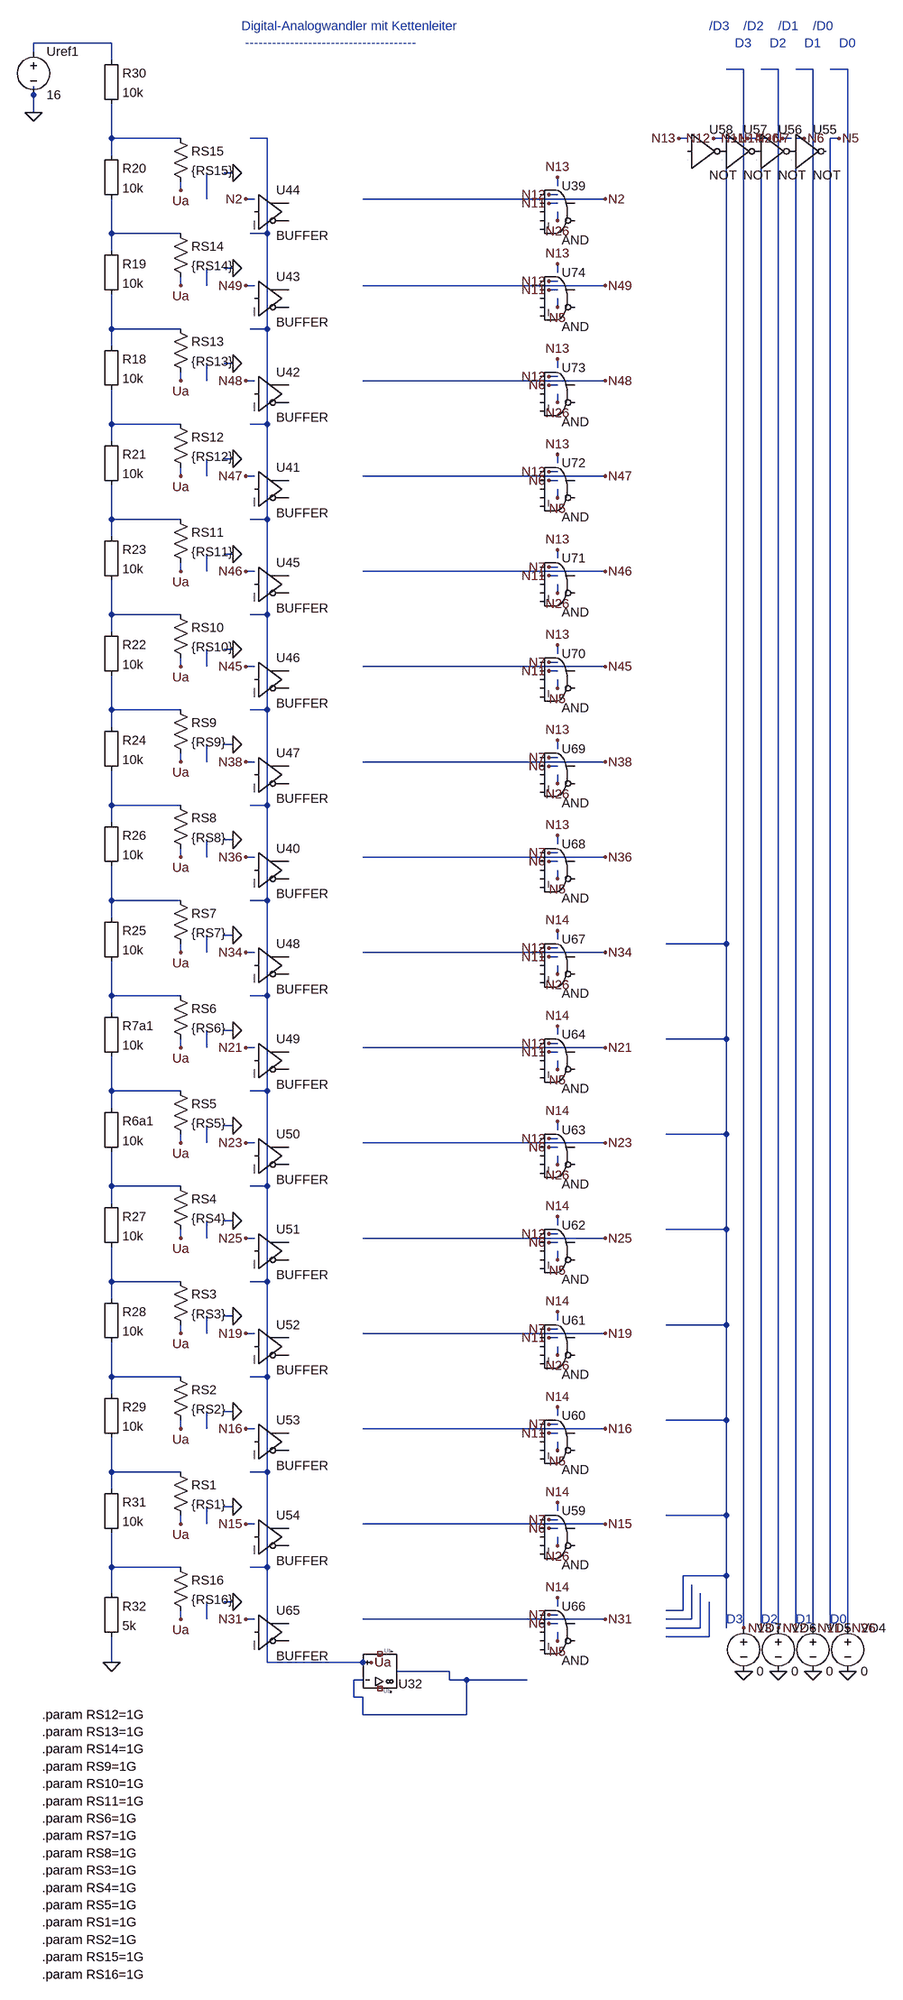
[diagram p0: schematic 8_1_1_2_DAC_4_Bit_mit_Kettenleiter.asc]
8_1_1_2_DAC_4_Bit_mit_Kettenleiter.asc, the LTspice schematic file:
Version 4
SHEET 1 880 680
WIRE 48 176 48 160
WIRE 656 3104 640 3104
WIRE 640 3104 640 3136
WIRE 640 3136 656 3136
WIRE 720 3088 816 3088
WIRE 816 3088 816 3104
WIRE 48 208 48 160
WIRE 192 544 192 608
WIRE 192 720 192 784
WIRE 416 848 400 848
WIRE 416 672 400 672
WIRE 192 368 192 432
WIRE 416 496 400 496
WIRE 448 608 480 608
WIRE 480 784 480 608
WIRE 192 1072 192 1136
WIRE 192 1248 192 1312
WIRE 416 1376 400 1376
WIRE 416 1200 400 1200
WIRE 416 1024 400 1024
WIRE 192 1776 192 1840
WIRE 416 1904 400 1904
WIRE 416 1728 400 1728
WIRE 416 1552 400 1552
WIRE 192 2128 192 2192
WIRE 192 2304 192 2368
WIRE 416 2432 400 2432
WIRE 416 2256 400 2256
WIRE 416 2080 400 2080
WIRE 192 2656 192 2720
WIRE 416 2784 400 2784
WIRE 416 2608 400 2608
WIRE 192 2480 192 2544
WIRE 192 1952 192 2016
WIRE 192 992 192 960
WIRE 192 1424 192 1488
WIRE 448 1136 480 1136
WIRE 448 960 480 960
WIRE 448 784 480 784
WIRE 480 1312 448 1312
WIRE 448 1488 480 1488
WIRE 448 1664 480 1664
WIRE 480 1488 480 1312
WIRE 480 1664 480 1488
WIRE 480 1840 448 1840
WIRE 480 2016 480 1840
WIRE 448 2016 480 2016
WIRE 480 2368 448 2368
WIRE 480 2544 480 2368
WIRE 448 2544 480 2544
WIRE 48 96 48 80
WIRE 48 80 192 80
WIRE 192 80 192 112
WIRE 416 320 400 320
WIRE 192 192 192 256
WIRE 448 432 480 432
WIRE 448 256 480 256
WIRE 480 256 480 432
WIRE 1088 368 656 368
WIRE 368 1376 368 1408
WIRE 368 1552 368 1584
WIRE 368 2256 368 2288
WIRE 368 2432 368 2464
WIRE 368 2608 368 2640
WIRE 368 880 368 848
WIRE 448 2192 480 2192
WIRE 480 2192 480 2368
WIRE 448 2720 480 2720
WIRE 480 2016 480 2192
WIRE 480 1664 480 1840
WIRE 480 1136 480 1312
WIRE 480 960 480 1136
WIRE 480 784 480 960
WIRE 480 432 480 608
WIRE 368 704 368 672
WIRE 368 528 368 496
WIRE 368 368 368 320
WIRE 368 1056 368 1024
WIRE 368 1232 368 1200
WIRE 368 1760 368 1728
WIRE 368 1936 368 1904
WIRE 368 2112 368 2080
WIRE 368 2816 368 2784
WIRE 192 2720 192 2752
WIRE 320 2720 192 2720
WIRE 192 2544 192 2576
WIRE 320 2544 192 2544
WIRE 192 2368 192 2400
WIRE 320 2368 192 2368
WIRE 192 2192 192 2224
WIRE 320 2192 192 2192
WIRE 192 2016 192 2048
WIRE 320 2016 192 2016
WIRE 192 1840 192 1872
WIRE 320 1840 192 1840
WIRE 192 1600 192 1664
WIRE 192 1488 192 1520
WIRE 320 1488 192 1488
WIRE 192 1312 192 1344
WIRE 320 1312 192 1312
WIRE 192 1136 192 1168
WIRE 320 1136 192 1136
WIRE 192 960 192 896
WIRE 320 960 192 960
WIRE 192 784 192 816
WIRE 320 784 192 784
WIRE 192 608 192 640
WIRE 320 608 192 608
WIRE 192 432 192 464
WIRE 320 432 192 432
WIRE 192 256 192 288
WIRE 320 256 192 256
WIRE 480 2720 480 2544
WIRE 1360 3008 1360 1568
WIRE 1520 3008 1520 2960
WIRE 1088 2816 656 2816
WIRE 1088 2640 656 2640
WIRE 1088 2464 656 2464
WIRE 1552 3008 1552 2848
WIRE 1392 3008 1392 2928
WIRE 1456 3008 1456 2944
WIRE 1520 2960 1520 2672
WIRE 1488 3008 1488 2656
WIRE 1392 2816 1392 2640
WIRE 1328 2800 1328 2624
WIRE 1088 1936 656 1936
WIRE 1088 2112 656 2112
WIRE 1088 2288 656 2288
WIRE 1552 2496 1552 2144
WIRE 1488 2480 1488 1952
WIRE 1392 2464 1392 1584
WIRE 1328 2448 1328 2272
WIRE 1424 3008 1424 2288
WIRE 1456 2832 1456 2304
WIRE 1520 2672 1520 2320
WIRE 192 2832 192 2896
WIRE 400 2960 416 2960
WIRE 368 2992 368 2960
WIRE 1552 2848 1552 2496
WIRE 1328 3008 1328 2912
WIRE 656 2992 1088 2992
WIRE 1328 2912 1328 2800
WIRE 1216 2976 1248 2976
WIRE 1248 2976 1248 2912
WIRE 1248 2912 1328 2912
WIRE 1392 2928 1392 2816
WIRE 1216 2992 1264 2992
WIRE 1264 2992 1264 2928
WIRE 1456 2944 1456 2832
WIRE 1216 3008 1280 3008
WIRE 1280 3008 1280 2944
WIRE 1216 3024 1296 3024
WIRE 1296 3024 1296 2960
WIRE 1216 2800 1328 2800
WIRE 1328 2624 1328 2448
WIRE 1216 2624 1328 2624
WIRE 1392 2640 1392 2464
WIRE 1488 2656 1488 2480
WIRE 1216 2448 1328 2448
WIRE 1328 2272 1328 2096
WIRE 1216 2272 1328 2272
WIRE 1424 2288 1424 2112
WIRE 1456 2304 1456 2128
WIRE 1520 2320 1520 1968
WIRE 1328 2096 1328 1920
WIRE 1216 2096 1328 2096
WIRE 1424 2112 1424 1936
WIRE 1552 2144 1552 1792
WIRE 1328 1920 1328 1744
WIRE 1216 1920 1328 1920
WIRE 1424 1936 1424 1760
WIRE 1456 2128 1456 1600
WIRE 1520 1968 1520 1616
WIRE 1488 1952 1488 1776
WIRE 1328 1744 1328 256
WIRE 1216 1744 1328 1744
WIRE 1424 1760 1424 880
WIRE 1488 1776 1488 1248
WIRE 1552 1792 1552 1440
WIRE 1360 1568 1360 1392
WIRE 1392 1584 1392 1408
WIRE 1456 1600 1456 1424
WIRE 1520 1616 1520 1264
WIRE 1360 1392 1360 1216
WIRE 1392 1408 1392 1232
WIRE 1456 1424 1456 896
WIRE 1552 1440 1552 1088
WIRE 1360 1216 1360 1040
WIRE 1392 1232 1392 1056
WIRE 1488 1248 1488 1072
WIRE 1360 1040 1360 864
WIRE 1392 1056 1392 256
WIRE 1488 1072 1488 544
WIRE 1520 1264 1520 912
WIRE 1552 1088 1552 736
WIRE 1360 864 1360 688
WIRE 1424 880 1424 704
WIRE 1456 896 1456 720
WIRE 1520 912 1520 560
WIRE 1360 688 1360 512
WIRE 1424 704 1424 528
WIRE 1456 720 1456 256
WIRE 1360 512 1360 352
WIRE 1424 528 1424 368
WIRE 1488 544 1488 384
WIRE 1520 560 1520 256
WIRE 1360 352 1360 128
WIRE 1360 128 1328 128
WIRE 1424 368 1424 128
WIRE 1424 128 1392 128
WIRE 1488 384 1488 128
WIRE 1488 128 1456 128
WIRE 656 1760 1088 1760
WIRE 656 1584 1088 1584
WIRE 656 1408 1088 1408
WIRE 1088 1232 656 1232
WIRE 656 1056 1088 1056
WIRE 1088 880 656 880
WIRE 1088 704 656 704
WIRE 656 528 1088 528
WIRE 192 2896 320 2896
WIRE 192 3072 192 3024
WIRE 1552 736 1552 400
WIRE 192 1664 192 1696
WIRE 320 1664 192 1664
WIRE 448 2896 480 2896
WIRE 1552 400 1552 128
WIRE 1552 128 1520 128
WIRE 480 2896 480 2720
WIRE 656 3072 480 3072
WIRE 480 3072 480 2896
WIRE 960 3104 848 3104
WIRE 848 3104 816 3104
WIRE 656 3136 656 3168
WIRE 656 3168 848 3168
WIRE 848 3168 848 3104
WIRE 192 2944 192 2896
WIRE 320 2976 320 2992
WIRE 320 2800 320 2816
WIRE 320 2624 320 2640
WIRE 320 2448 320 2464
WIRE 320 2272 320 2288
WIRE 320 2096 320 2112
WIRE 320 1920 320 1936
WIRE 320 1744 320 1760
WIRE 320 1568 320 1584
WIRE 320 1392 320 1408
WIRE 320 1216 320 1232
WIRE 320 1040 320 1056
WIRE 320 864 320 880
WIRE 320 688 320 704
WIRE 320 512 320 528
WIRE 320 336 320 352
WIRE 656 3072 672 3072
WIRE 1016 1064 1000 1064
WIRE 1016 1240 1000 1240
WIRE 1016 1768 1000 1768
WIRE 1016 1944 1000 1944
WIRE 1016 2472 1000 2472
WIRE 1016 2648 1000 2648
WIRE 1016 536 1000 536
WIRE 1384 256 1368 256
WIRE 1016 376 1000 376
WIRE 1016 696 1000 696
WIRE 1016 872 1000 872
WIRE 1016 1752 1000 1752
WIRE 1016 1928 1000 1928
WIRE 1016 2104 1000 2104
WIRE 1016 2280 1000 2280
WIRE 1016 520 1000 520
WIRE 1320 256 1304 256
WIRE 1016 360 1000 360
WIRE 1016 680 1016 664
WIRE 1016 856 1016 840
WIRE 1016 1032 1016 1016
WIRE 1016 1208 1016 1192
WIRE 1016 1384 1016 1368
WIRE 1016 1560 1016 1544
WIRE 1016 504 1016 488
WIRE 1256 256 1240 256
WIRE 1016 344 1016 328
WIRE 1088 368 1104 368
WIRE 456 368 440 368
WIRE 1016 1256 1016 1272
WIRE 1016 1608 1016 1624
WIRE 1016 1960 1016 1976
WIRE 1016 2312 1016 2328
WIRE 1016 2664 1016 2680
WIRE 1016 3016 1016 3032
WIRE 1016 904 1016 920
WIRE 1520 256 1536 256
WIRE 1016 552 1016 568
WIRE 1016 1416 1000 1416
WIRE 1016 1592 1000 1592
WIRE 1016 2120 1000 2120
WIRE 1016 2296 1000 2296
WIRE 1016 2824 1000 2824
WIRE 1016 3000 1000 3000
WIRE 1016 888 1000 888
WIRE 1456 256 1472 256
WIRE 1016 712 1000 712
WIRE 1016 1400 1000 1400
WIRE 1016 1576 1000 1576
WIRE 1016 2456 1000 2456
WIRE 1016 2632 1000 2632
WIRE 1016 2808 1000 2808
WIRE 1016 2984 1000 2984
WIRE 1016 1224 1000 1224
WIRE 1392 256 1408 256
WIRE 1016 1048 1000 1048
WIRE 1016 2088 1016 2072
WIRE 1016 2264 1016 2248
WIRE 1016 2440 1016 2424
WIRE 1016 2616 1016 2600
WIRE 1016 2792 1016 2776
WIRE 1016 2968 1016 2952
WIRE 1016 1912 1016 1896
WIRE 1328 256 1344 256
WIRE 1016 1736 1016 1720
WIRE 1088 2816 1104 2816
WIRE 456 2816 440 2816
WIRE 1088 2640 1104 2640
WIRE 456 2640 440 2640
WIRE 1088 2464 1104 2464
WIRE 456 2464 440 2464
WIRE 1088 1936 1104 1936
WIRE 456 1936 440 1936
WIRE 1088 2112 1104 2112
WIRE 456 2112 440 2112
WIRE 1088 2288 1104 2288
WIRE 456 2288 440 2288
WIRE 456 2992 440 2992
WIRE 1088 2992 1104 2992
WIRE 456 1760 440 1760
WIRE 1088 1760 1104 1760
WIRE 456 1584 440 1584
WIRE 1088 1584 1104 1584
WIRE 456 1408 440 1408
WIRE 1088 1408 1104 1408
WIRE 1088 1232 1104 1232
WIRE 456 1232 440 1232
WIRE 456 1056 440 1056
WIRE 1088 1056 1104 1056
WIRE 1088 880 1104 880
WIRE 456 880 440 880
WIRE 1088 704 1104 704
WIRE 456 704 440 704
WIRE 456 528 440 528
WIRE 1088 528 1104 528
WIRE 1016 728 1016 744
WIRE 1016 1080 1016 1096
WIRE 1016 1432 1016 1448
WIRE 1016 1784 1016 1800
WIRE 1016 2136 1016 2152
WIRE 1016 2488 1016 2504
WIRE 1016 2840 1016 2856
WIRE 1448 256 1432 256
WIRE 1016 392 1016 408
FLAG 1552 3088 0
FLAG 1488 3088 0
FLAG 1424 3088 0
FLAG 1360 3088 0
FLAG 48 208 0
FLAG 192 3072 0
FLAG 416 848 0
FLAG 416 672 0
FLAG 416 496 0
FLAG 416 1376 0
FLAG 416 1200 0
FLAG 416 1024 0
FLAG 416 1904 0
FLAG 416 1728 0
FLAG 416 1552 0
FLAG 416 2432 0
FLAG 416 2256 0
FLAG 416 2080 0
FLAG 416 2784 0
FLAG 416 2608 0
FLAG 416 320 0
FLAG 416 2960 0
FLAG 48 208 0
FLAG 192 3072 0
FLAG 416 848 0
FLAG 416 672 0
FLAG 416 496 0
FLAG 416 1376 0
FLAG 416 1200 0
FLAG 416 1024 0
FLAG 416 1904 0
FLAG 416 1728 0
FLAG 416 1552 0
FLAG 416 2432 0
FLAG 416 2256 0
FLAG 416 2080 0
FLAG 416 2784 0
FLAG 416 2608 0
FLAG 416 320 0
FLAG 416 2960 0
FLAG 320 2992 Ua
FLAG 320 2816 Ua
FLAG 320 2640 Ua
FLAG 320 2464 Ua
FLAG 320 2288 Ua
FLAG 320 2112 Ua
FLAG 320 1936 Ua
FLAG 320 1760 Ua
FLAG 320 1584 Ua
FLAG 320 1408 Ua
FLAG 320 1232 Ua
FLAG 320 1056 Ua
FLAG 320 880 Ua
FLAG 320 704 Ua
FLAG 320 528 Ua
FLAG 320 352 Ua
FLAG 672 3072 Ua
FLAG 1000 1064 N11
FLAG 1000 1240 N11
FLAG 1000 1768 N11
FLAG 1000 1944 N11
FLAG 1000 2472 N11
FLAG 1488 3008 N11
FLAG 1000 2648 N11
FLAG 1000 536 N11
FLAG 1368 256 N11
FLAG 1000 376 N11
FLAG 1000 696 N12
FLAG 1000 872 N12
FLAG 1000 1752 N12
FLAG 1000 1928 N12
FLAG 1000 2104 N12
FLAG 1424 3008 N12
FLAG 1000 2280 N12
FLAG 1000 520 N12
FLAG 1304 256 N12
FLAG 1000 360 N12
FLAG 1016 664 N13
FLAG 1016 840 N13
FLAG 1016 1016 N13
FLAG 1016 1192 N13
FLAG 1016 1368 N13
FLAG 1360 3008 N13
FLAG 1016 1544 N13
FLAG 1016 488 N13
FLAG 1240 256 N13
FLAG 1016 328 N13
FLAG 1104 368 N2
FLAG 440 368 N2
FLAG 1016 1272 N5
FLAG 1016 1624 N5
FLAG 1016 1976 N5
FLAG 1016 2328 N5
FLAG 1016 2680 N5
FLAG 1016 3032 N5
FLAG 1016 920 N5
FLAG 1536 256 N5
FLAG 1016 568 N5
FLAG 1000 1416 N6
FLAG 1000 1592 N6
FLAG 1000 2120 N6
FLAG 1000 2296 N6
FLAG 1000 2824 N6
FLAG 1000 3000 N6
FLAG 1000 888 N6
FLAG 1472 256 N6
FLAG 1000 712 N6
FLAG 1000 1400 N7
FLAG 1000 1576 N7
FLAG 1000 2456 N7
FLAG 1000 2632 N7
FLAG 1000 2808 N7
FLAG 1000 2984 N7
FLAG 1000 1224 N7
FLAG 1408 256 N7
FLAG 1000 1048 N7
FLAG 1016 2072 N14
FLAG 1016 2248 N14
FLAG 1016 2424 N14
FLAG 1016 2600 N14
FLAG 1016 2776 N14
FLAG 1016 2952 N14
FLAG 1016 1896 N14
FLAG 1344 256 N14
FLAG 1016 1720 N14
FLAG 1104 2816 N15
FLAG 440 2816 N15
FLAG 1104 2640 N16
FLAG 440 2640 N16
FLAG 1104 2464 N19
FLAG 440 2464 N19
FLAG 1104 1936 N21
FLAG 440 1936 N21
FLAG 1104 2112 N23
FLAG 440 2112 N23
FLAG 1104 2288 N25
FLAG 440 2288 N25
FLAG 440 2992 N31
FLAG 1104 2992 N31
FLAG 440 1760 N34
FLAG 1104 1760 N34
FLAG 440 1584 N36
FLAG 1104 1584 N36
FLAG 440 1408 N38
FLAG 1104 1408 N38
FLAG 1104 1232 N45
FLAG 440 1232 N45
FLAG 440 1056 N46
FLAG 1104 1056 N46
FLAG 1104 880 N47
FLAG 440 880 N47
FLAG 1104 704 N48
FLAG 440 704 N48
FLAG 440 528 N49
FLAG 1104 528 N49
FLAG 1016 744 N26
FLAG 1016 1096 N26
FLAG 1016 1448 N26
FLAG 1016 1800 N26
FLAG 1016 2152 N26
FLAG 1016 2504 N26
FLAG 1552 3008 N26
FLAG 1016 2856 N26
FLAG 1432 256 N26
FLAG 1016 408 N26
SYMBOL voltage 48 80 R0
SYMATTR InstName Uref1
SYMATTR Value 16
SYMBOL Misc\EuropeanResistor 176 624 R0
SYMATTR InstName R18
SYMATTR Value 10k
SYMBOL UniversalOpAmp2 688 3088 M180
SYMATTR InstName U32
SYMATTR Value UniversalOpAmp2
SYMBOL Misc\EuropeanResistor 176 448 R0
SYMATTR InstName R19
SYMATTR Value 10k
SYMBOL Misc\EuropeanResistor 176 272 R0
SYMATTR InstName R20
SYMATTR Value 10k
SYMBOL res 304 768 R0
SYMATTR InstName RS12
SYMATTR Value {RS12}
SYMBOL res 304 592 R0
SYMATTR InstName RS13
SYMATTR Value {RS13}
SYMBOL res 304 416 R0
SYMATTR InstName RS14
SYMATTR Value {RS14}
SYMBOL Misc\EuropeanResistor 176 800 R0
SYMATTR InstName R21
SYMATTR Value 10k
SYMBOL voltage 1552 2992 R0
SYMATTR InstName VD4
SYMATTR Value 0
SYMBOL voltage 1488 2992 R0
SYMATTR InstName VD5
SYMATTR Value 0
SYMBOL Misc\EuropeanResistor 176 1152 R0
SYMATTR InstName R22
SYMATTR Value 10k
SYMBOL Misc\EuropeanResistor 176 976 R0
SYMATTR InstName R23
SYMATTR Value 10k
SYMBOL res 304 1296 R0
SYMATTR InstName RS9
SYMATTR Value {RS9}
SYMBOL res 304 1120 R0
SYMATTR InstName RS10
SYMATTR Value {RS10}
SYMBOL res 304 944 R0
SYMATTR InstName RS11
SYMATTR Value {RS11}
SYMBOL Misc\EuropeanResistor 176 1328 R0
SYMATTR InstName R24
SYMATTR Value 10k
SYMBOL Misc\EuropeanResistor 176 1680 R0
SYMATTR InstName R25
SYMATTR Value 10k
SYMBOL Misc\EuropeanResistor 176 1504 R0
SYMATTR InstName R26
SYMATTR Value 10k
SYMBOL res 304 1824 R0
SYMATTR InstName RS6
SYMATTR Value {RS6}
SYMBOL res 304 1648 R0
SYMATTR InstName RS7
SYMATTR Value {RS7}
SYMBOL res 304 1472 R0
SYMATTR InstName RS8
SYMATTR Value {RS8}
SYMBOL Misc\EuropeanResistor 176 1856 R0
SYMATTR InstName R7a1
SYMATTR Value 10k
SYMBOL Misc\EuropeanResistor 176 2208 R0
SYMATTR InstName R27
SYMATTR Value 10k
SYMBOL Misc\EuropeanResistor 176 2032 R0
SYMATTR InstName R6a1
SYMATTR Value 10k
SYMBOL res 304 2352 R0
SYMATTR InstName RS3
SYMATTR Value {RS3}
SYMBOL res 304 2176 R0
SYMATTR InstName RS4
SYMATTR Value {RS4}
SYMBOL res 304 2000 R0
SYMATTR InstName RS5
SYMATTR Value {RS5}
SYMBOL Misc\EuropeanResistor 176 2384 R0
SYMATTR InstName R28
SYMATTR Value 10k
SYMBOL Misc\EuropeanResistor 176 2560 R0
SYMATTR InstName R29
SYMATTR Value 10k
SYMBOL res 304 2704 R0
SYMATTR InstName RS1
SYMATTR Value {RS1}
SYMBOL res 304 2528 R0
SYMATTR InstName RS2
SYMATTR Value {RS2}
SYMBOL res 304 240 R0
SYMATTR InstName RS15
SYMATTR Value {RS15}
SYMBOL Misc\EuropeanResistor 176 96 R0
SYMATTR InstName R30
SYMATTR Value 10k
SYMBOL voltage 1424 2992 R0
SYMATTR InstName VD6
SYMATTR Value 0
SYMBOL voltage 1360 2992 R0
SYMATTR InstName VD7
SYMATTR Value 0
SYMBOL Digital\and 1016 328 R0
SYMATTR InstName U39
SYMATTR Value AND
SYMATTR LibreSpice gate=and;inputs=4;vth=2.5;vhigh=5;pins=In1,In2,In3,In4,Out
SYMBOL Digital\buf 456 1544 R0
SYMATTR InstName U40
SYMATTR Value BUFFER
SYMATTR LibreSpice gate=buffer;inputs=1;vth=2.5;vhigh=5;pins=In1,Out
SYMBOL Digital\buf 456 840 R0
SYMATTR InstName U41
SYMATTR Value BUFFER
SYMATTR LibreSpice gate=buffer;inputs=1;vth=2.5;vhigh=5;pins=In1,Out
SYMBOL Digital\buf 456 664 R0
SYMATTR InstName U42
SYMATTR Value BUFFER
SYMATTR LibreSpice gate=buffer;inputs=1;vth=2.5;vhigh=5;pins=In1,Out
SYMBOL Digital\buf 456 488 R0
SYMATTR InstName U43
SYMATTR Value BUFFER
SYMATTR LibreSpice gate=buffer;inputs=1;vth=2.5;vhigh=5;pins=In1,Out
SYMBOL Digital\buf 456 328 R0
SYMATTR InstName U44
SYMATTR Value BUFFER
SYMATTR LibreSpice gate=buffer;inputs=1;vth=2.5;vhigh=5;pins=In1,Out
SYMBOL Digital\buf 456 1016 R0
SYMATTR InstName U45
SYMATTR Value BUFFER
SYMATTR LibreSpice gate=buffer;inputs=1;vth=2.5;vhigh=5;pins=In1,Out
SYMBOL Digital\buf 456 1192 R0
SYMATTR InstName U46
SYMATTR Value BUFFER
SYMATTR LibreSpice gate=buffer;inputs=1;vth=2.5;vhigh=5;pins=In1,Out
SYMBOL Digital\buf 456 1368 R0
SYMATTR InstName U47
SYMATTR Value BUFFER
SYMATTR LibreSpice gate=buffer;inputs=1;vth=2.5;vhigh=5;pins=In1,Out
SYMBOL Digital\buf 456 1720 R0
SYMATTR InstName U48
SYMATTR Value BUFFER
SYMATTR LibreSpice gate=buffer;inputs=1;vth=2.5;vhigh=5;pins=In1,Out
SYMBOL Digital\buf 456 1896 R0
SYMATTR InstName U49
SYMATTR Value BUFFER
SYMATTR LibreSpice gate=buffer;inputs=1;vth=2.5;vhigh=5;pins=In1,Out
SYMBOL Digital\buf 456 2072 R0
SYMATTR InstName U50
SYMATTR Value BUFFER
SYMATTR LibreSpice gate=buffer;inputs=1;vth=2.5;vhigh=5;pins=In1,Out
SYMBOL Digital\buf 456 2248 R0
SYMATTR InstName U51
SYMATTR Value BUFFER
SYMATTR LibreSpice gate=buffer;inputs=1;vth=2.5;vhigh=5;pins=In1,Out
SYMBOL Digital\buf 456 2424 R0
SYMATTR InstName U52
SYMATTR Value BUFFER
SYMATTR LibreSpice gate=buffer;inputs=1;vth=2.5;vhigh=5;pins=In1,Out
SYMBOL Digital\buf 456 2600 R0
SYMATTR InstName U53
SYMATTR Value BUFFER
SYMATTR LibreSpice gate=buffer;inputs=1;vth=2.5;vhigh=5;pins=In1,Out
SYMBOL Digital\buf 456 2776 R0
SYMATTR InstName U54
SYMATTR Value BUFFER
SYMATTR LibreSpice gate=buffer;inputs=1;vth=2.5;vhigh=5;pins=In1,Out
SYMBOL Digital\inv 1448 216 R0
SYMATTR InstName U55
SYMATTR Value NOT
SYMATTR LibreSpice gate=not;inputs=1;vth=2.5;vhigh=5;pins=In1,Out
SYMBOL Digital\inv 1384 216 R0
SYMATTR InstName U56
SYMATTR Value NOT
SYMATTR LibreSpice gate=not;inputs=1;vth=2.5;vhigh=5;pins=In1,Out
SYMBOL Digital\inv 1320 216 R0
SYMATTR InstName U57
SYMATTR Value NOT
SYMATTR LibreSpice gate=not;inputs=1;vth=2.5;vhigh=5;pins=In1,Out
SYMBOL Digital\inv 1256 216 R0
SYMATTR InstName U58
SYMATTR Value NOT
SYMATTR LibreSpice gate=not;inputs=1;vth=2.5;vhigh=5;pins=In1,Out
SYMBOL Digital\and 1016 2776 R0
SYMATTR InstName U59
SYMATTR Value AND
SYMATTR LibreSpice gate=and;inputs=4;vth=2.5;vhigh=5;pins=In1,In2,In3,In4,Out
SYMBOL Digital\and 1016 2600 R0
SYMATTR InstName U60
SYMATTR Value AND
SYMATTR LibreSpice gate=and;inputs=4;vth=2.5;vhigh=5;pins=In1,In2,In3,In4,Out
SYMBOL Digital\and 1016 2424 R0
SYMATTR InstName U61
SYMATTR Value AND
SYMATTR LibreSpice gate=and;inputs=4;vth=2.5;vhigh=5;pins=In1,In2,In3,In4,Out
SYMBOL Digital\and 1016 2248 R0
SYMATTR InstName U62
SYMATTR Value AND
SYMATTR LibreSpice gate=and;inputs=4;vth=2.5;vhigh=5;pins=In1,In2,In3,In4,Out
SYMBOL Digital\and 1016 2072 R0
SYMATTR InstName U63
SYMATTR Value AND
SYMATTR LibreSpice gate=and;inputs=4;vth=2.5;vhigh=5;pins=In1,In2,In3,In4,Out
SYMBOL Digital\and 1016 1896 R0
SYMATTR InstName U64
SYMATTR Value AND
SYMATTR LibreSpice gate=and;inputs=4;vth=2.5;vhigh=5;pins=In1,In2,In3,In4,Out
SYMBOL Misc\EuropeanResistor 176 2736 R0
SYMATTR InstName R31
SYMATTR Value 10k
SYMBOL res 304 2880 R0
SYMATTR InstName RS16
SYMATTR Value {RS16}
SYMBOL Digital\buf 456 2952 R0
SYMATTR InstName U65
SYMATTR Value BUFFER
SYMATTR LibreSpice gate=buffer;inputs=1;vth=2.5;vhigh=5;pins=In1,Out
SYMBOL Digital\and 1016 2952 R0
SYMATTR InstName U66
SYMATTR Value AND
SYMATTR LibreSpice gate=and;inputs=4;vth=2.5;vhigh=5;pins=In1,In2,In3,In4,Out
SYMBOL Digital\and 1016 1720 R0
SYMATTR InstName U67
SYMATTR Value AND
SYMATTR LibreSpice gate=and;inputs=4;vth=2.5;vhigh=5;pins=In1,In2,In3,In4,Out
SYMBOL Digital\and 1016 1544 R0
SYMATTR InstName U68
SYMATTR Value AND
SYMATTR LibreSpice gate=and;inputs=4;vth=2.5;vhigh=5;pins=In1,In2,In3,In4,Out
SYMBOL Digital\and 1016 1368 R0
SYMATTR InstName U69
SYMATTR Value AND
SYMATTR LibreSpice gate=and;inputs=4;vth=2.5;vhigh=5;pins=In1,In2,In3,In4,Out
SYMBOL Digital\and 1016 1192 R0
SYMATTR InstName U70
SYMATTR Value AND
SYMATTR LibreSpice gate=and;inputs=4;vth=2.5;vhigh=5;pins=In1,In2,In3,In4,Out
SYMBOL Digital\and 1016 1016 R0
SYMATTR InstName U71
SYMATTR Value AND
SYMATTR LibreSpice gate=and;inputs=4;vth=2.5;vhigh=5;pins=In1,In2,In3,In4,Out
SYMBOL Digital\and 1016 840 R0
SYMATTR InstName U72
SYMATTR Value AND
SYMATTR LibreSpice gate=and;inputs=4;vth=2.5;vhigh=5;pins=In1,In2,In3,In4,Out
SYMBOL Digital\and 1016 664 R0
SYMATTR InstName U73
SYMATTR Value AND
SYMATTR LibreSpice gate=and;inputs=4;vth=2.5;vhigh=5;pins=In1,In2,In3,In4,Out
SYMBOL Digital\and 1016 488 R0
SYMATTR InstName U74
SYMATTR Value AND
SYMATTR LibreSpice gate=and;inputs=4;vth=2.5;vhigh=5;pins=In1,In2,In3,In4,Out
SYMBOL Misc\EuropeanResistor 176 2928 R0
SYMATTR InstName R32
SYMATTR Value 5k
TEXT 64 3168 Left 2 !.param RS12=1G
TEXT 64 3200 Left 2 !.param RS13=1G
TEXT 64 3232 Left 2 !.param RS14=1G
TEXT 64 3264 Left 2 !.param RS9=1G
TEXT 64 3296 Left 2 !.param RS10=1G
TEXT 64 3328 Left 2 !.param RS11=1G
TEXT 64 3360 Left 2 !.param RS6=1G
TEXT 64 3392 Left 2 !.param RS7=1G
TEXT 64 3424 Left 2 !.param RS8=1G
TEXT 64 3456 Left 2 !.param RS3=1G
TEXT 64 3488 Left 2 !.param RS4=1G
TEXT 64 3520 Left 2 !.param RS5=1G
TEXT 64 3552 Left 2 !.param RS1=1G
TEXT 64 3584 Left 2 !.param RS2=1G
TEXT 64 3616 Left 2 !.param RS15=1G
TEXT 64 3648 Left 2 !.param RS16=1G
TEXT 432 48 Left 2 ;Digital-Analogwandler mit Kettenleiter \n --------------------------------------
TEXT 1344 80 Left 2 ;D3
TEXT 1408 80 Left 2 ;D2
TEXT 1472 80 Left 2 ;D1
TEXT 1536 80 Left 2 ;D0
TEXT 1328 2992 Left 2 ;D3
TEXT 1392 2992 Left 2 ;D2
TEXT 1456 2992 Left 2 ;D1
TEXT 1520 2992 Left 2 ;D0
TEXT 1296 48 Left 2 ;/D3
TEXT 1360 48 Left 2 ;/D2
TEXT 1424 48 Left 2 ;/D1
TEXT 1488 48 Left 2 ;/D0

The netlist it stands for:
* 8_1_1_2_DAC_4_Bit_mit_Kettenleiter.asc
V§Uref1 N015 0 16
R18 N002 N003 10k
XU32 Ua N001 NC_01 NC_02 N001 level2 UniversalOpAmp2 Avol=1Meg GBW=10Meg Slew=10Meg Ilimit=25m Rail=0 Vos=0 En=0 Enk=0 In=0 Ink=0 Rin=500Meg  ; pins In+ In- V+ V- OUT
R19 N004 N002 10k
R20 N016 N004 10k
RS12 N003 Ua {RS12}
RS13 N002 Ua {RS13}
RS14 N004 Ua {RS14}
R21 N003 N013 10k
VD4 N26 0 0
VD5 N11 0 0
R22 N005 N006 10k
R23 N013 N005 10k
RS9 N006 Ua {RS9}
RS10 N005 Ua {RS10}
RS11 N013 Ua {RS11}
R24 N006 N014 10k
R25 N032 N007 10k
R26 N014 N032 10k
RS6 N007 Ua {RS6}
RS7 N032 Ua {RS7}
RS8 N014 Ua {RS8}
R7a1 N007 N012 10k
R27 N008 N009 10k
R6a1 N012 N008 10k
RS3 N009 Ua {RS3}
RS4 N008 Ua {RS4}
RS5 N012 Ua {RS5}
R28 N009 N011 10k
R29 N011 N010 10k
RS1 N010 Ua {RS1}
RS2 N011 Ua {RS2}
RS15 N016 Ua {RS15}
R30 N015 N016 10k
VD6 N12 0 0
VD7 N13 0 0
A§U39 0 0 0 0 0 0 0 0 AND AND
A§U40 0 0 0 0 0 0 0 0 BUF BUFFER
A§U41 0 0 0 0 0 0 0 0 BUF BUFFER
A§U42 0 0 0 0 0 0 0 0 BUF BUFFER
A§U43 0 0 0 0 0 0 0 0 BUF BUFFER
A§U44 0 0 0 0 0 0 0 0 BUF BUFFER
A§U45 0 0 0 0 0 0 0 0 BUF BUFFER
A§U46 0 0 0 0 0 0 0 0 BUF BUFFER
A§U47 0 0 0 0 0 0 0 0 BUF BUFFER
A§U48 0 0 0 0 0 0 0 0 BUF BUFFER
A§U49 0 0 0 0 0 0 0 0 BUF BUFFER
A§U50 0 0 0 0 0 0 0 0 BUF BUFFER
A§U51 0 0 0 0 0 0 0 0 BUF BUFFER
A§U52 0 0 0 0 0 0 0 0 BUF BUFFER
A§U53 0 0 0 0 0 0 0 0 BUF BUFFER
A§U54 0 0 0 0 0 0 0 0 BUF BUFFER
A§U55 P001 0 0 0 0 0 0 0 BUF NOT
A§U56 P002 0 0 0 0 P001 0 0 BUF NOT
A§U57 P003 0 0 0 0 P002 0 0 BUF NOT
A§U58 0 0 0 0 0 P003 0 0 BUF NOT
A§U59 0 0 0 0 0 0 0 0 AND AND
A§U60 0 0 0 0 0 0 0 0 AND AND
A§U61 0 0 0 0 0 0 0 0 AND AND
A§U62 0 0 0 0 0 0 0 0 AND AND
A§U63 0 0 0 0 0 0 0 0 AND AND
A§U64 0 0 0 0 0 0 0 0 AND AND
R31 N010 N033 10k
RS16 N033 Ua {RS16}
A§U65 0 0 0 0 0 0 0 0 BUF BUFFER
A§U66 0 0 0 0 0 0 0 0 AND AND
A§U67 0 0 0 0 0 0 0 0 AND AND
A§U68 0 0 0 0 0 0 0 0 AND AND
A§U69 0 0 0 0 0 0 0 0 AND AND
A§U70 0 0 0 0 0 0 0 0 AND AND
A§U71 0 0 0 0 0 0 0 0 AND AND
A§U72 0 0 0 0 0 0 0 0 AND AND
A§U73 0 0 0 0 0 0 0 0 AND AND
A§U74 0 0 0 0 0 0 0 0 AND AND
R32 N033 0 5k
.param RS12=1G
.param RS13=1G
.param RS14=1G
.param RS9=1G
.param RS10=1G
.param RS11=1G
.param RS6=1G
.param RS7=1G
.param RS8=1G
.param RS3=1G
.param RS4=1G
.param RS5=1G
.param RS1=1G
.param RS2=1G
.param RS15=1G
.param RS16=1G
* Digital-Analogwandler mit Kettenleiter
*  --------------------------------------
* D3
* D2
* D1
* D0
* D3
* D2
* D1
* D0
* /D3
* /D2
* /D1
* /D0
.lib UniversalOpAmp2.lib
.backanno
.end